# Altium project PCB_Project1.PrjPCB
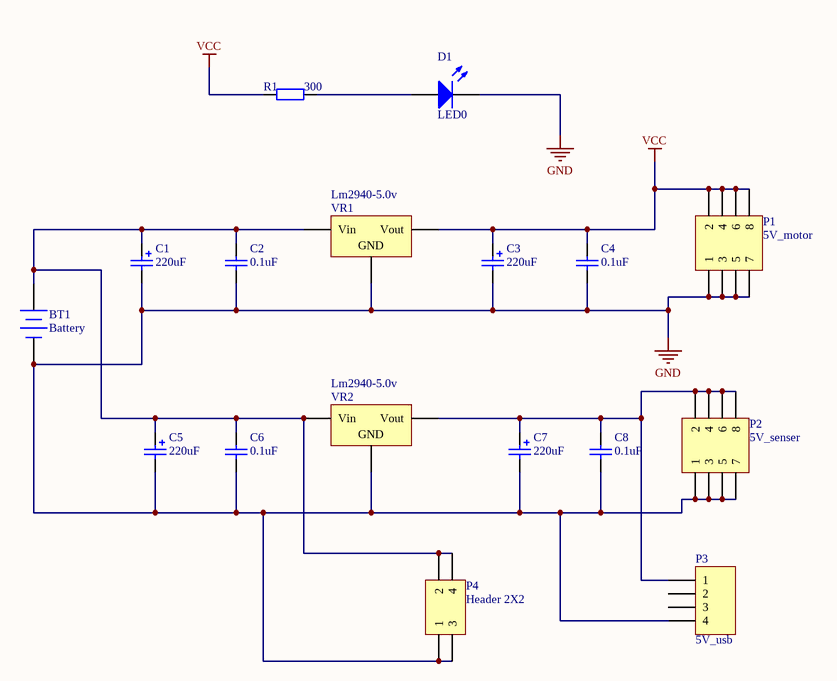
[diagram p0: Sheet1.SchDoc]
1 sheet, 17 parts. Net scope: global (net labels, ports and power ports of the same name join across sheets).
Board file: PCB1.PcbDoc

## Sheet Sheet1.SchDoc
size A4

### Parts
BT1  Battery  [DC5V-1]
C1  value 220uF  [ELEC-10UF]  (hidden comment: Cap Pol2)
C2  value 0.1uF  [CAP-DIP]  (hidden comment: Cap)
C3  value 220uF  [ELEC-10UF]  (hidden comment: Cap Pol2)
C4  value 0.1uF  [CAP-DIP]  (hidden comment: Cap)
C5  value 220uF  [ELEC-10UF]  (hidden comment: Cap Pol2)
C6  value 0.1uF  [CAP-DIP]  (hidden comment: Cap)
C7  value 220uF  [ELEC-10UF]  (hidden comment: Cap Pol2)
C8  value 0.1uF  [CAP-DIP]  (hidden comment: Cap)
D1  LED0  [LED-DIP]
P1  5V_motor  [HDR2X4]
P2  5V_senser  [HDR2X4]
P3  5V_usb  [USB]
P4  Header 2X2  [HDR2X2]
R1  value 300  [RES-300MIL]  (hidden comment: Res2)
VR1  Lm2940-5.0v  [7805-DIP1]
VR2  Lm2940-5.0v  [7805-DIP1]

### Nets
GND: BT1.2(-) C1.2 C2.1 C3.2 C4.1 C5.2 C6.1 C7.2 C8.1 D1.2(K) P1.1 P1.3 P1.5 P1.7 P2.1 P2.3 P2.5 P2.7 P3.4 P4.1 P4.3 VR1.2(GND) VR2.2(GND)
VCC: C3.1 C4.2 P1.2 P1.4 P1.6 P1.8 R1.1 VR1.3(Vout)
NetBT1_1: BT1.1(+) C1.1 C2.2 C5.1 C6.2 P4.2 P4.4 VR1.1(Vin) VR2.1(Vin)
NetC7_1: C7.1 C8.2 P2.2 P2.4 P2.6 P2.8 P3.1 VR2.3(Vout)
NetD1_1: D1.1(A) R1.2

Not connected (* = marked no-connect by the designer): BT1 3(GND); P3 2 3

### Library data of the parts
BT1 = Battery: Multicell Battery; Published: 24-Mar-1999; LatestRevisionDate: 17-Jul-2002; LatestRevisionNote: Re-released for DXP Platform.; PackageReference: BAT-2; Publisher: Altium Limited
C1 C3 C5 C7 = Cap Pol2: Polarized Capacitor (Axial); Published: 8-Jun-2000; LatestRevisionDate: 17-Jul-2002; LatestRevisionNote: Re-released for DXP Platform.; PackageReference: POLAR0.8; Publisher: Altium Limited
C2 C4 C6 C8 = Cap: Capacitor; Published: 8-Jun-2000; LatestRevisionDate: 17-Jul-2002; LatestRevisionNote: Re-released for DXP Platform.; PackageReference: RAD-0.3; Publisher: Altium Limited
D1 = LED0: Typical INFRARED GaAs LED; Published: 8-Jun-2000; LatestRevisionDate: 08-Jul-2005; LatestRevisionNote: Mech Layer 1 removed.; PackageReference: LED-0; Publisher: Altium Limited
P1 P2 = Header 4X2: Header, 4-Pin, Dual row; LatestRevisionDate: 17-Jul-2002; LatestRevisionNote: Re-released for DXP Platform.; Publisher: Altium Limited
P3 = Header 4: Header, 4-Pin; LatestRevisionDate: 17-Jul-2002; LatestRevisionNote: Re-released for DXP Platform.; Publisher: Altium Limited
P4 = Header 2X2: Header, 2-Pin, Dual row; LatestRevisionDate: 17-Jul-2002; LatestRevisionNote: Re-released for DXP Platform.; Publisher: Altium Limited
R1 = Res2: Resistor; Published: 8-Jun-2000; LatestRevisionDate: 17-Jul-2002; LatestRevisionNote: Re-released for DXP Platform.; PackageReference: AXIAL-0.4; Publisher: Altium Limited
VR1 VR2 = Volt Reg: Voltage Regulator; Published: 24-Mar-1999; LatestRevisionDate: 17-Jul-2002; LatestRevisionNote: Re-released for DXP Platform.; PackageReference: D2PAK; Publisher: Altium Limited; Code_JEDEC: SMD-220